# Altium schematic sheet POWER SUPPLY.SchDoc: POWER SUPPLY
size B; Organization: Carnegie Institution of Washington; DocumentNumber: 8; SheetNumber: 8; SheetTotal: 8; PageSetup: Record=PageOptions|CenterHorizontal=True|CenterVertical=True|PrintScale=1.12|XCorrection=1.00|YCorrection=1.00|PrintKind=0|BorderSize=5000000|LeftOffset=0|BottomOffset=0|Orientation=2|PaperLength=1000|PaperWidth=1000|Scale=100|PaperSource=15|PrintQuality=1200|MediaType=1|DitherType=10|PaperKind=11 x 17|PrintScaleMode=1
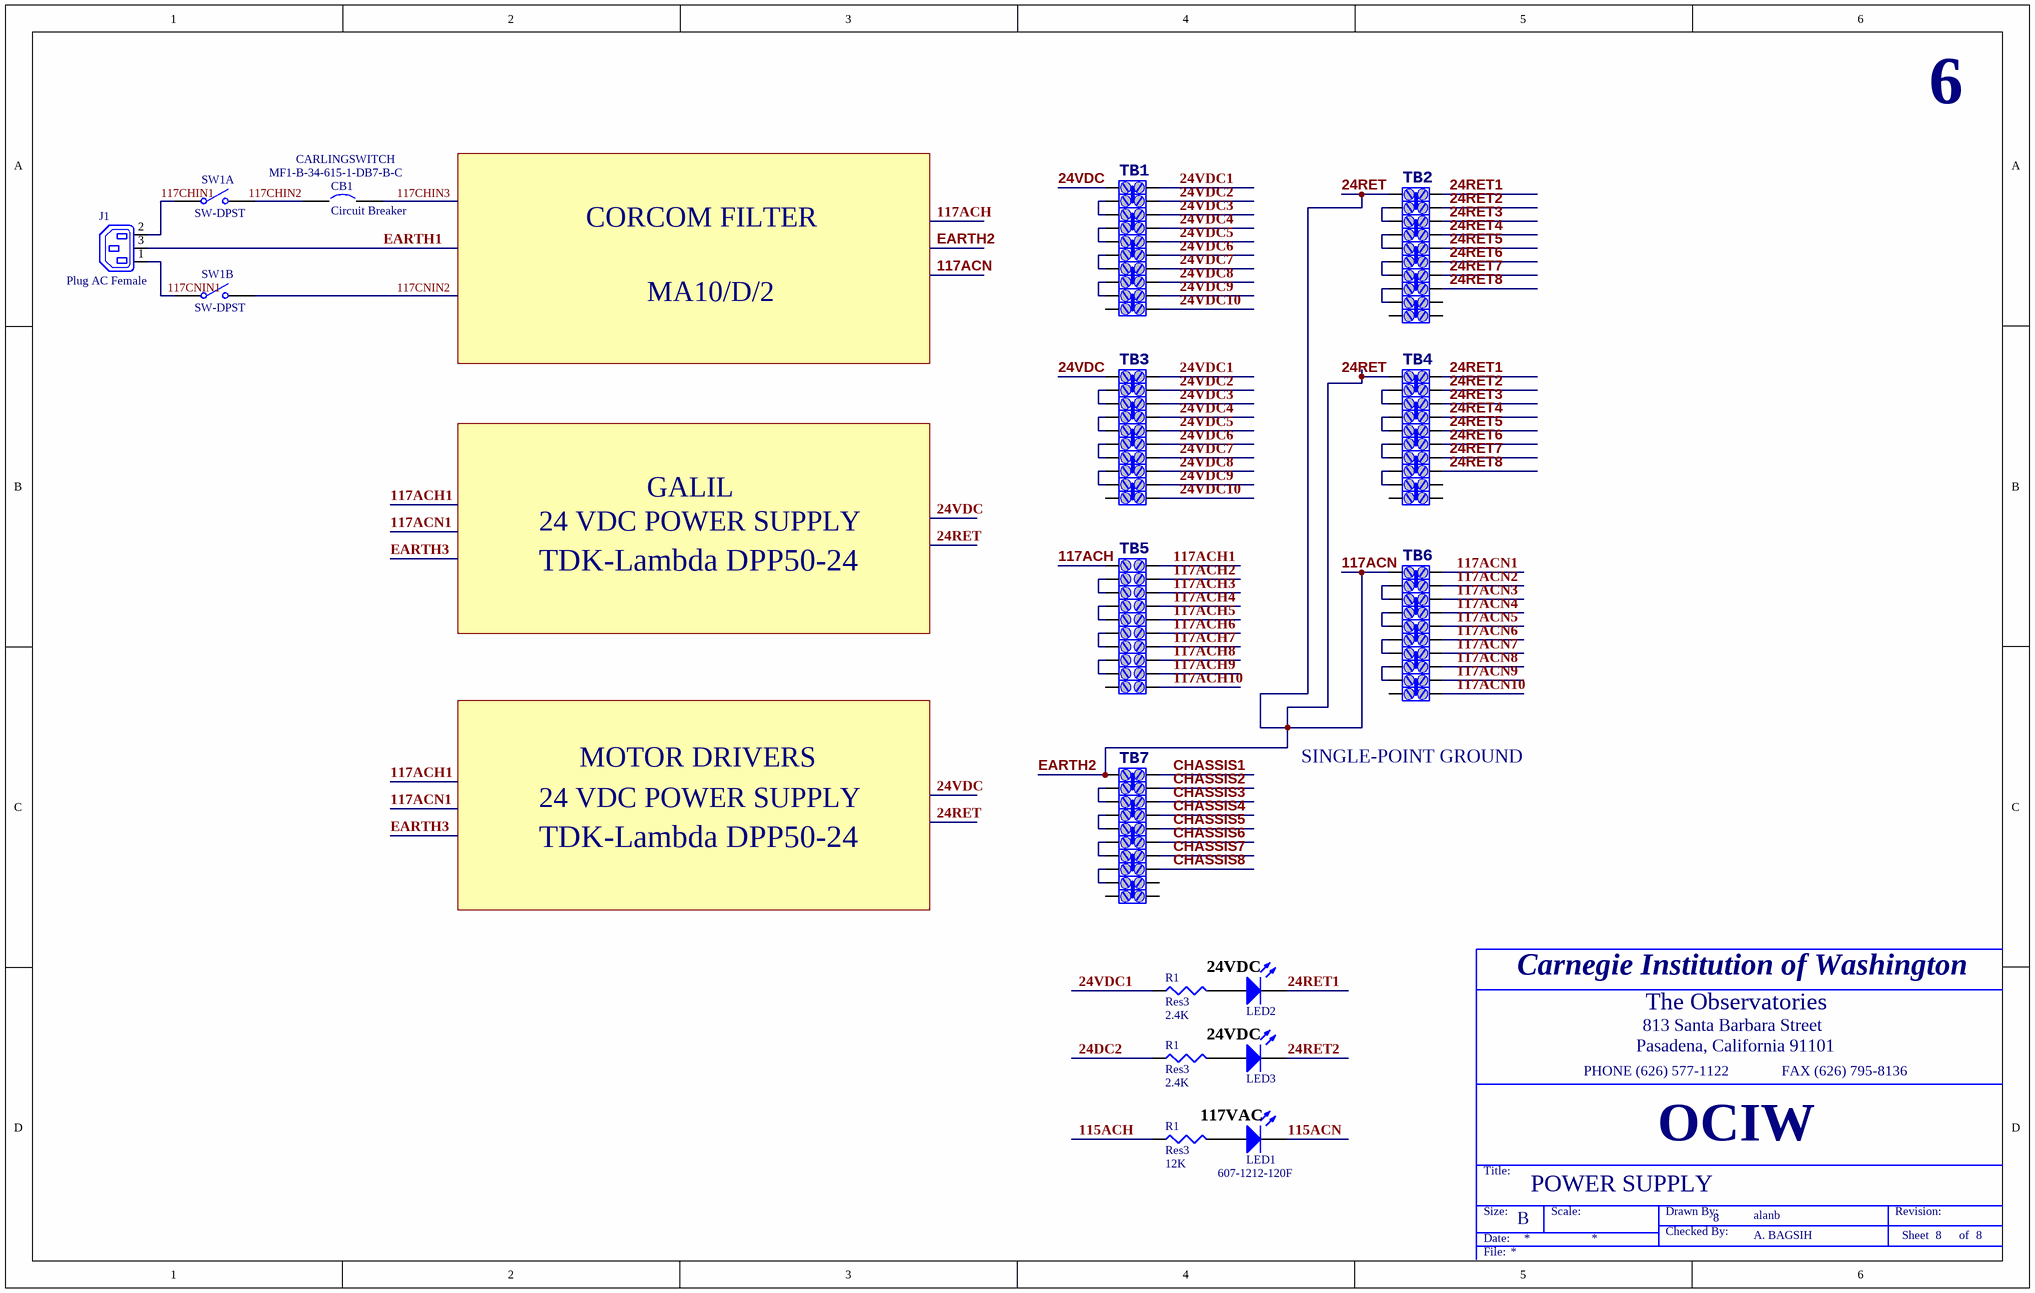
[diagram p0: POWER SUPPLY.SchDoc]

## Parts
(Parts that share a designator on the sheet are numbered #1, #2 ... from top to bottom, then left to right.)
?#1  (no value)
?#2  (no value)
?#3  (no value)
?#4  (no value)
?#5  (no value)
?#6  (no value)
?#7  (no value)
?#8  (no value)
?#9  (no value)
?#10  (no value)
?#11  (no value)
?#12  (no value)
?#13  (no value)
?#14  (no value)
?#15  (no value)
?#16  (no value)
?#17  (no value)
?#18  (no value)
?#19  (no value)
?#20  (no value)
?#21  (no value)
?#22  (no value)
?#23  (no value)
?#24  (no value)
?#25  (no value)
?#26  (no value)
?#27  (no value)
?#28  (no value)
?#29  (no value)
?#30  (no value)
?#31  (no value)
?#32  (no value)
?#33  (no value)
?#34  (no value)
?#35  (no value)
?#36  (no value)
?#37  (no value)
?#38  (no value)
?#39  (no value)
?#40  (no value)
?#41  (no value)
?#42  (no value)
?#43  (no value)
?#44  (no value)
?#45  (no value)
?#46  (no value)
?#47  (no value)
?#48  (no value)
?#49  (no value)
?#50  (no value)
?#51  (no value)
?#52  (no value)
?#53  (no value)
?#54  (no value)
?#55  (no value)
?#56  (no value)
?#57  (no value)
?#58  (no value)
?#59  (no value)
?#60  (no value)
?#61  (no value)
?#62  (no value)
?#63  (no value)
CB1  Circuit Breaker  Manufacturer: CARLINGSWITCH  PART#: MF1-B-34-615-1-DB7-B-C  [SPST-2]
D?#1  LED2  [LED-0]
D?#2  LED3  [LED-0]
D?#3  LED1  Manuf #: 607-1212-120F  [LED-0]
J1  Plug AC Female  [IEC7-2H3]
R1#1  Res3  value 2.4K  [J1-0603]
R1#2  Res3  value 2.4K  [J1-0603]
R1#3  Res3  value 12K  [J1-0603]
SW1A  SW-DPST  [SPST-2]
SW1B  SW-DPST  [SPST-2]
TB1  (no value)
TB2  (no value)
TB3  (no value)
TB4  (no value)
TB5  (no value)
TB6  (no value)
TB7  (no value)

## Nets
24DC2: R1#2.1
24RET1: D?#1.2(K) TB2.1 TB4.1
24RET2: ?#2.1 ?#20.1 D?#2.2(K)
24RET3: ?#4.1 ?#22.1
24RET4: ?#6.1 ?#24.1
24RET5: ?#8.1 ?#26.1
24RET6: ?#10.1 ?#28.1
24RET7: ?#12.1 ?#30.1
24RET8: ?#14.1 ?#32.1
24VDC: TB1.2 TB3.2
24VDC1: R1#1.1 TB1.1 TB3.1
24VDC2: ?#1.1 ?#19.1
24VDC3: ?#3.1 ?#21.1
24VDC4: ?#5.1 ?#23.1
24VDC5: ?#7.1 ?#25.1
24VDC6: ?#9.1 ?#27.1
24VDC7: ?#11.1 ?#29.1
24VDC8: ?#13.1 ?#31.1
24VDC9: ?#15.1 ?#33.1
24VDC10: ?#17.1 ?#35.1
115ACH: R1#3.1
115ACN: D?#3.2(K)
117ACH: TB5.2
117ACH1: TB5.1
117ACH2: ?#37.1
117ACH3: ?#39.1
117ACH4: ?#41.1
117ACH5: ?#43.1
117ACH6: ?#45.1
117ACH7: ?#47.1
117ACH8: ?#49.1
117ACH9: ?#51.1
117ACH10: ?#53.1
117ACN: TB2.2 TB4.2 TB6.2 TB7.2  [also labelled 24RET, EARTH2]
117ACN1: TB6.1
117ACN2: ?#38.1
117ACN3: ?#40.1
117ACN4: ?#42.1
117ACN5: ?#44.1
117ACN6: ?#46.1
117ACN7: ?#48.1
117ACN8: ?#50.1
117ACN9: ?#52.1
117ACN10: ?#54.1
117CHIN1: J1.2(N) SW1A.1(COMMON)
117CHIN3: CB1.2
117CNIN1: J1.1(L) SW1B.1(COMMON)
117CNIN2: SW1B.2(NO)
CHASSIS1: TB7.1
CHASSIS2: ?#55.1
CHASSIS3: ?#56.1
CHASSIS4: ?#57.1
CHASSIS5: ?#58.1
CHASSIS6: ?#59.1
CHASSIS7: ?#60.1
CHASSIS8: ?#61.1
EARTH1: J1.3(E)
NetCB1_1: CB1.1 SW1A.2(NO)
NetD?#1_1: D?#1.1(A) R1#1.2
NetD?#2_1: D?#2.1(A) R1#2.2
NetD?#3_1: D?#3.1(A) R1#3.2

Not connected (* = marked no-connect by the designer): ?#1 2; ?#2 2; ?#3 2; ?#4 2; ?#5 2; ?#6 2; ?#7 2; ?#8 2; ?#9 2; ?#10 2; ?#11 2; ?#12 2; ?#13 2; ?#14 2; ?#15 2; ?#16 1 2; ?#17 2; ?#18 1 2; ?#19 2; ?#20 2; ?#21 2; ?#22 2; ?#23 2; ?#24 2; ?#25 2; ?#26 2; ?#27 2; ?#28 2; ?#29 2; ?#30 2; ?#31 2; ?#32 2; ?#33 2; ?#34 1 2; ?#35 2; ?#36 1 2; ?#37 2; ?#38 2; ?#39 2; ?#40 2; ?#41 2; ?#42 2; ?#43 2; ?#44 2; ?#45 2; ?#46 2; ?#47 2; ?#48 2; ?#49 2; ?#50 2; ?#51 2; ?#52 2; ?#53 2; ?#54 2; ?#55 2; ?#56 2; ?#57 2; ?#58 2; ?#59 2; ?#60 2; ?#61 2; ?#62 1 2; ?#63 1 2

## Notes on the sheet
- 6
- CORCOM FILTER
- MA10/D/2
- GALIL
- 24 VDC POWER SUPPLY
- TDK-Lambda DPP50-24
- MOTOR DRIVERS
- SINGLE-POINT GROUND
- 24VDC
- 117VAC
- Labels drawn without touching a wire or pin: 24RET, 117CHIN2
- Carnegie Institution of Washington
- 813 Santa Barbara Street
- The Observatories
- PHONE (626) 577-1122               FAX (626) 795-8136
- Pasadena, California 91101
- Title:
- OCIW
- Size:
- Date:
- B
- Scale:
- Drawn By:
- Checked By:
- A. BAGSIH
- alanb
- Revision:
- Sheet          of
- File:

## Library data of the parts
?#1 ?#2 ?#19 ?#20 ?#38 ?#55 = TB3: Part Field 1: 23; Part Field 2: 24
?#3 ?#4 ?#21 ?#22 ?#40 ?#56 = TB3: Part Field 1: 25; Part Field 2: 26
?#5 ?#6 ?#23 ?#24 ?#42 ?#57 = TB3: Part Field 1: 27; Part Field 2: 28
?#7 ?#8 ?#25 ?#26 ?#44 ?#58 TB5 = TB3: Part Field 1: 29; Part Field 2: 30
?#9 ?#10 ?#27 ?#28 ?#37 ?#46 ?#59 = TB3: Part Field 1: 31; Part Field 2: 32
?#11 ?#12 ?#29 ?#30 ?#39 ?#48 ?#60 = TB3: Part Field 1: 33; Part Field 2: 34
?#13 ?#14 ?#31 ?#32 ?#41 ?#50 ?#61 = TB3: Part Field 1: 35; Part Field 2: 36
?#15 ?#16 ?#33 ?#34 ?#43 ?#52 ?#62 = TB3: Part Field 1: 37; Part Field 2: 38
?#17 ?#18 ?#35 ?#36 ?#45 ?#54 ?#63 = TB3: Part Field 1: 39; Part Field 2: 40
?#47 = TB3: Part Field 1: 41; Part Field 2: 42
?#49 = TB3: Part Field 1: 43; Part Field 2: 44
?#51 = TB3: Part Field 1: 45; Part Field 2: 46
?#53 = TB3: Part Field 1: 47; Part Field 2: 48
D?#1 D?#2 = LED0: Typical INFRARED GaAs LED; Manuf #: 607-1212-120F; Published: 8-Jun-2000; LatestRevisionDate: 08-Jul-2005; LatestRevisionNote: Mech Layer 1 removed.; PackageReference: LED-0; Publisher: Altium Limited
D?#3 = LED0: Typical INFRARED GaAs LED; Published: 8-Jun-2000; LatestRevisionDate: 08-Jul-2005; LatestRevisionNote: Mech Layer 1 removed.; PackageReference: LED-0; Publisher: Altium Limited
J1 = Plug AC Female: IEC Mains Power Outlet, EN60 320-2-2 F Class I, PC Flange Rear Mount, Chassis Socket; PackageDocument: ver.80, 15-Sep-2003; MaximumRating: 10A, 250V a.c. (UL & CSA 15A, 250V a.c.); MountingFixtures: Not drawn on schematic symbol.; PCB_Layout: Complies with manufacturer's recommendation.; DrillSize: Corresponds to nominal value.; Published: 15-Jul-2004; LatestRevisionDate: 15-Jul-2004; LatestRevisionNote: Component Replaced & renamed from "Phonejack".; DatasheetDocument: ver.80, 15-Sep-2003; PackageReference: PX0675/PC; Publisher: Altium Limited; Terminations: P.C. Spills; ComponentLink1Description: Manufacturer Link; ComponentLink1URL: http://www.bulgin.co.uk/
R1#1-R1#3 = Res3: Resistor; Published: 8-Jun-2000; LatestRevisionDate: 04-Mar-2005; LatestRevisionNote: PCB Footprint replaced.; PackageReference: J1-0603; Publisher: Altium Limited
SW1A SW1B = SW-SPST: Single-Pole, Single-Throw Switch; Published: 24-Mar-1999; LatestRevisionDate: 17-Jul-2002; LatestRevisionNote: Re-released for DXP Platform.; PackageReference: SPST-2; Publisher: Altium Limited
TB1-TB4 TB6 TB7 = TB3: Part Field 1: 21; Part Field 2: 22
CB1 = Circuit Breaker: Published: 24-Mar-1999; LatestRevisionDate: 17-Jul-2002; LatestRevisionNote: Re-released for DXP Platform.; PackageReference: SPST-2; Publisher: Altium Limited